# EAGLE design untitled (EAGLE 6.1)
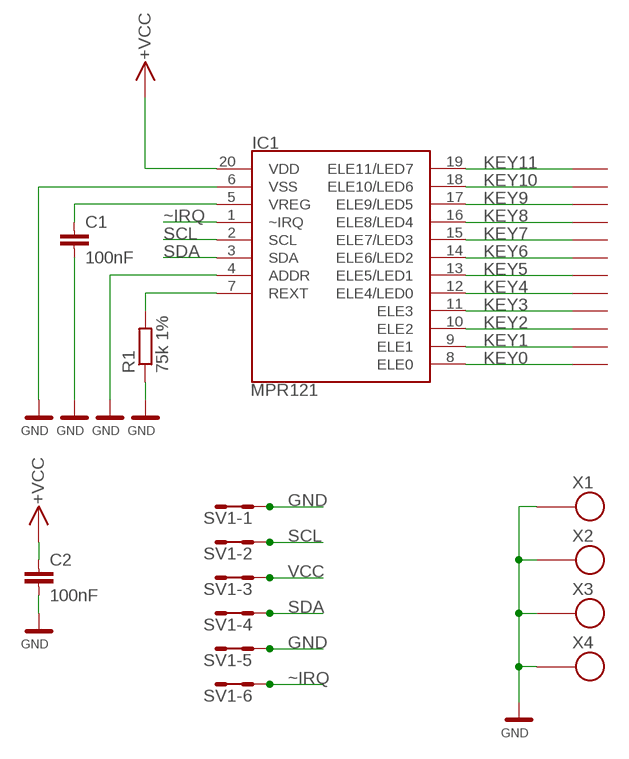
[diagram p0: schematic, sheet 1]

## Parts
C1  100nF  C0805  [C0805]
C2  100nF  C0805  [C0805]
IC1  MPR121  MPR121QFN20  [QFN-20-0.4MM]
R1  75k 1%  R0805  [0805]
SV1  MA06-2  [MA06-2]
U$1  TL_DOTYK_10_15  [PLOSKA10_15]
U$2  TL_DOTYK_10_15  [PLOSKA10_15]
U$3  TL_DOTYK_10_15  [PLOSKA10_15]
U$4  TL_DOTYK_10_15  [PLOSKA10_15]
U$5  TL_DOTYK_10_15  [PLOSKA10_15]
U$6  TL_DOTYK_10_15  [PLOSKA10_15]
U$7  TL_DOTYK_10_15  [PLOSKA10_15]
U$8  TL_DOTYK_10_15  [PLOSKA10_15]
U$9  TL_DOTYK_10_15  [PLOSKA10_15]
U$10  TL_DOTYK_10_15  [PLOSKA10_15]
U$11  TL_DOTYK_10_15  [PLOSKA10_15]
U$12  TL_DOTYK_10_15  [PLOSKA10_15]
X1  SROUB3M  [SROUB3M]
X2  SROUB3M  [SROUB3M]
X3  SROUB3M  [SROUB3M]
X4  SROUB3M  [SROUB3M]

## Nets
GND: C1.2 C2.2 IC1.4(ADDR) IC1.6(VSS) R1.1 SV1.1 SV1.2 SV1.9 SV1.10 X1.P$1 X2.P$1 X3.P$1 X4.P$1
KEY0: IC1.8(ELE0) U$1.P$1
KEY1: IC1.9(ELE1) U$2.P$1
KEY2: IC1.10(ELE2) U$3.P$1
KEY3: IC1.11(ELE3) U$4.P$1
KEY4: IC1.12(ELE4/LED0) U$5.P$1
KEY5: IC1.13(ELE5/LED1) U$6.P$1
KEY6: IC1.14(ELE6/LED2) U$7.P$1
KEY7: IC1.15(ELE7/LED3) U$8.P$1
KEY8: IC1.16(ELE8/LED4) U$9.P$1
KEY9: IC1.17(ELE9/LED5) U$10.P$1
KEY10: IC1.18(ELE10/LED6) U$11.P$1
KEY11: IC1.19(ELE11/LED7) U$12.P$1
REXT: IC1.7(REXT) R1.2
SCL: IC1.2(SCL) SV1.3 SV1.4
SDA: IC1.3(SDA) SV1.7 SV1.8
VCC: C2.1 IC1.20(VDD) SV1.5 SV1.6 ; supply symbol labelled +VCC
VREG: C1.1 IC1.5(VREG)
~IRQ: IC1.1(~IRQ) SV1.11 SV1.12

## Library data of the parts
C1 C2 = moje_C:C0805
IC1 = SparkFun:MPR121: MPR121 Capacitive Touch Sensor Controller
R1 = moje_R:R0805
SV1 = moje_hrebinky:MA06-2: PIN HEADER; OC_FARNELL: unknown; OC_NEWARK: unknown
U$1-U$12 = moje_tlacitka:TL_DOTYK_10_15: Ploska pro kapacitni talcitko 10x15mm
X1-X4 = moje:SROUB3M

## Board
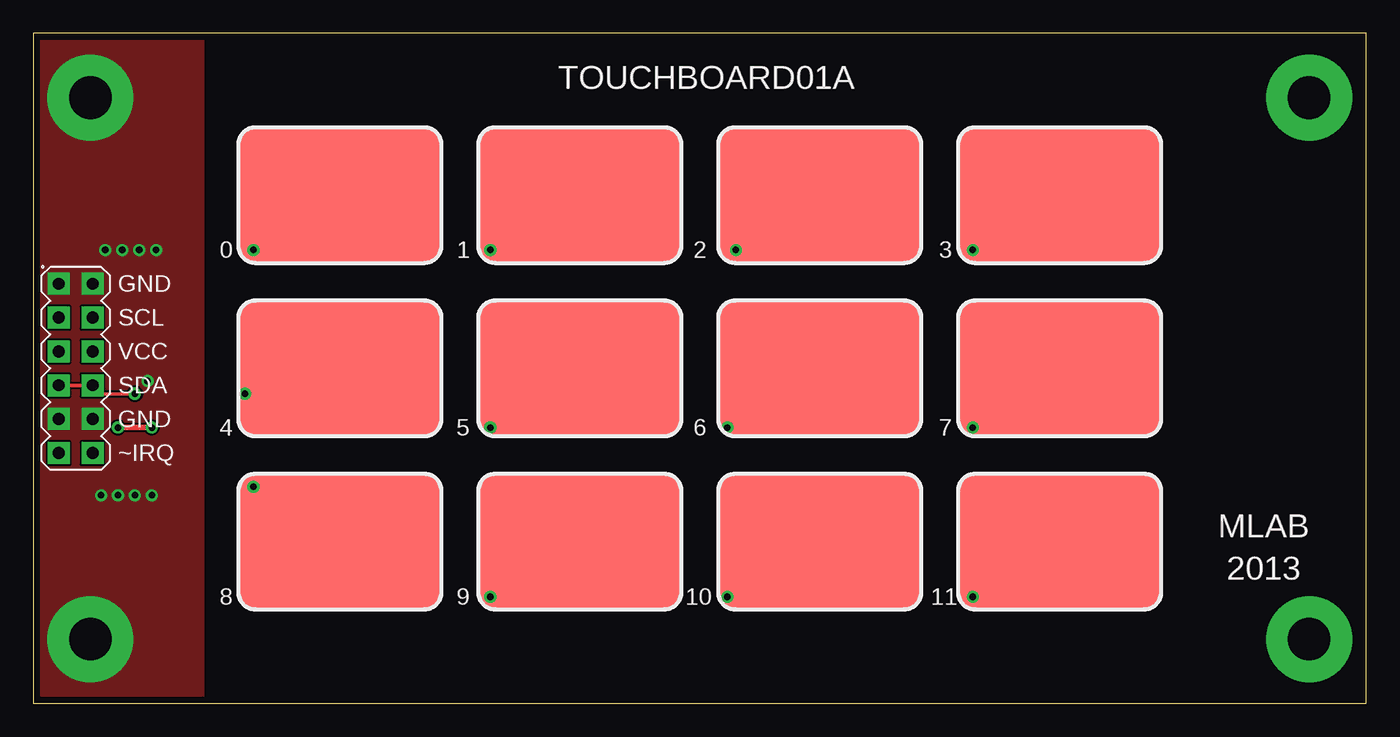
[diagram p1: board, top side]
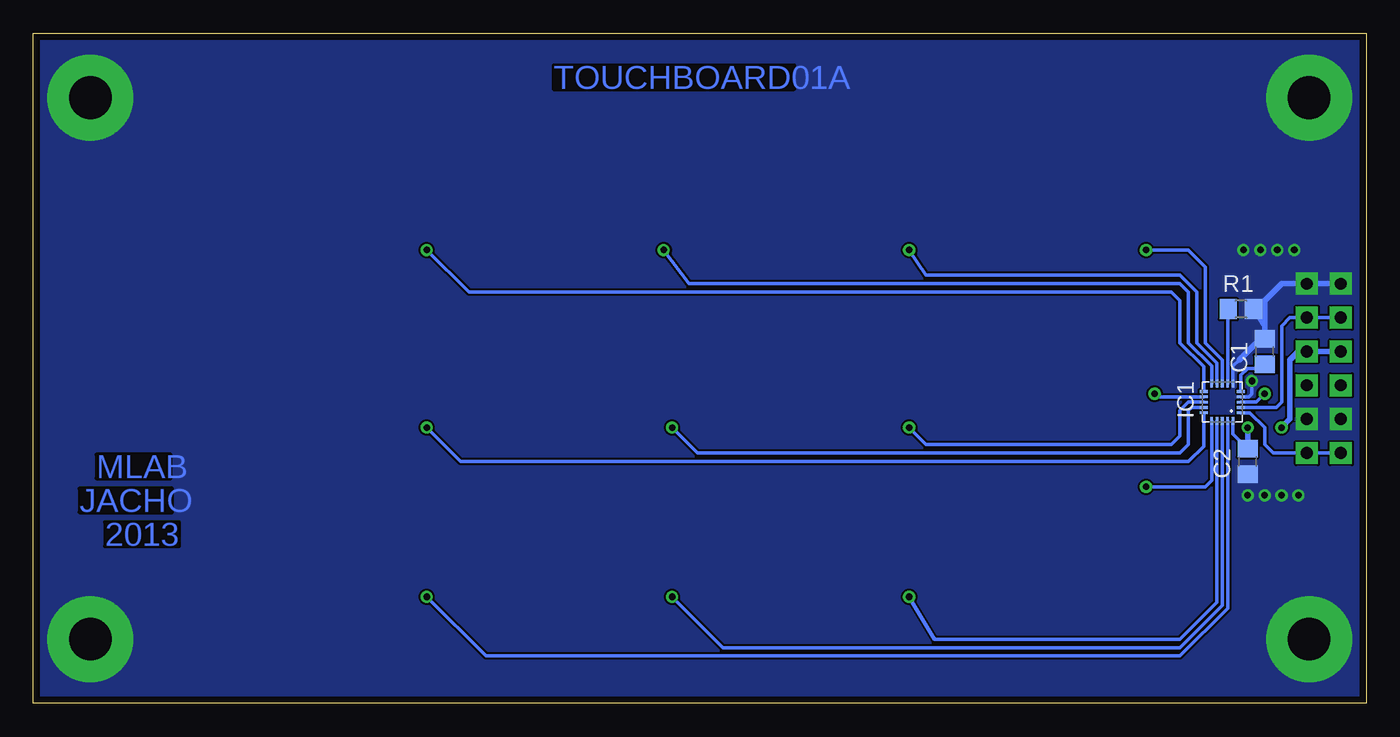
[diagram p2: board, bottom side, seen from below]

Size 100 x 50.29 mm. Coordinates in mm from the lower left corner, seen from the top.
Outline: 0,0 100,0 100,50.29 0,50.29 0,0
Copper layers (1*16): Top 0.035mm / dielectric 1.5mm / Bottom 0.035mm
Design rules: minimum track width 8mil, minimum drill 16mil, track to track 6mil, track to pad 6mil, pad to pad 6mil, via to via 6mil, smd to smd 6mil, copper to edge 20mil, drill to drill 8mil, minimum pad ring 10mil, minimum via ring 8mil, stop-mask expansion 4mil, vias tented up to drill 25mil, thermal gap 0mil

### Footprints (pad centres in the part's own frame; a part is rotated, then mirrored left to right if it is on the bottom)
C0805 = smd 1.3 x 1.5: 1 -0.95,0; 2 0.95,0
QFN-20-0.4MM = smd 0.6 x 0.2: 1 -1.4,0.8; 2 -1.4,0.4; 3 -1.4,0; 4 -1.4,-0.4; 5 -1.4,-0.8; 11 1.4,-0.8; 12 1.4,-0.4; 13 1.4,0; 14 1.4,0.4; 15 1.4,0.8 | smd 0.2 x 0.6: 6 -0.8,-1.4; 7 -0.4,-1.4; 8 0,-1.4; 9 0.4,-1.4; 10 0.8,-1.4; 16 0.8,1.4; 17 0.4,1.4; 18 0,1.4; 19 -0.4,1.4; 20 -0.8,1.4
0805 = smd 1.3 x 1.5: 1 -0.95,0; 2 0.95,0
MA06-2 = drill 0.889 pad 1.651 square: 1 -6.35,-1.27; 2 -6.35,1.27; 3 -3.81,-1.27; 4 -3.81,1.27; 5 -1.27,-1.27; 6 -1.27,1.27; 7 1.27,-1.27; 8 1.27,1.27; 9 3.81,-1.27; 10 3.81,1.27; 11 6.35,-1.27; 12 6.35,1.27
PLOSKA10_15 = smd 15 x 10: P$1 0,0
SROUB3M = drill 3.2 pad 6.452: P$1 0,0

### Placement (x,y rotation side)
C1  7.62,26.42 90 bottom
C2  8.89,18.16 270 bottom
IC1  10.79,22.61 180 bottom
R1  9.4,29.59 180 bottom
SV1  3.17,25.15 270 top
U$1  23,38.15 0 top
U$2  41,38.15 0 top
U$3  59,38.15 0 top
U$4  77,38.15 0 top
U$5  23,25.15 0 top
U$6  41,25.15 0 top
U$7  59,25.15 0 top
U$8  77,25.15 0 top
U$9  23,12.15 0 top
U$10  41,12.15 0 top
U$11  59,12.15 0 top
U$12  77,12.15 0 top
X1  4.28,4.83 0 top
X2  95.72,4.83 0 top
X3  4.28,45.47 0 top
X4  95.72,45.47 0 top

### Tracks (layer width: path | path; a pad name or v marks a point on that pad's centre or on a via)
GND  (via drill 0.5)
  Bottom 0.254: IC1.6 9.99,25.31 9.53,25.78 | IC1.4 8.81,23.01 8.57,23.24 v8.57,24.19
  Bottom 0.406: 9.53,25.78 8.26,27.05 7.94,27.05 C1.2 7.62,28.32 | SV1.1 SV1.2 6.35,31.5 7.62,30.23 7.62,28.32 | R1.1 7.62,28.32
  other vias: 5.08,15.62 6.35,15.62 7.62,15.62 8.89,15.62 5.4,34.04 6.67,34.04 7.94,34.04 9.21,34.04
  pour Bottom: 0,50.55 0,-0.25 99.69,-0.25 99.69,50.55
  pour Top: 0.64,50.55 0,50.55 0,-0.25 12.7,-0.25 12.7,49.91
KEY0  (via drill 0.5)
  Top 0.254: v16.51,34.04 19.05,34.04 22.86,37.85 22.86,38.01 U$1.P$1
  Bottom 0.254: v16.51,34.04 13.34,34.04 12.06,32.77 12.06,27.05 10.79,25.78 IC1.8
KEY1  (via drill 0.5)
  Top 0.254: v34.29,34.04 36.89,34.04 U$2.P$1
  Bottom 0.254: IC1.9 11.2,25.55 12.7,27.05 12.7,30.86 13.97,32.13 33.02,32.13 v34.29,34.04
KEY2  (via drill 0.5)
  Top 0.254: v52.7,34.04 54.89,34.04 U$3.P$1
  Bottom 0.254: IC1.10 11.6,25.31 13.34,27.05 13.34,30.86 13.97,31.5 50.8,31.5 v52.7,34.04
KEY3  (via drill 0.5)
  Top 0.254: v70.48,34.04 72.89,34.04 U$4.P$1
  Bottom 0.254: IC1.11 12.2,25.28 13.97,27.05 13.97,30.23 14.61,30.86 67.31,30.86 v70.48,34.04
KEY4  (via drill 0.5)
  Top 0.254: v15.88,23.24 22.86,23.24 22.86,25.15 U$5.P$1
  Bottom 0.254: IC1.12 15.88,23.01 v15.88,23.24
KEY5  (via drill 0.5)
  Top 0.254: v34.29,20.7 36.55,20.7 U$6.P$1
  Bottom 0.254: v34.29,20.7 33.02,19.43 14.61,19.43 13.97,20.07 13.97,21.97 13.34,22.61 IC1.13
KEY6  (via drill 0.5)
  Top 0.254: v52.07,20.7 54.55,20.7 U$7.P$1
  Bottom 0.254: v52.07,20.7 50.16,18.8 13.97,18.8 13.34,19.43 13.34,21.97 13.1,22.21 IC1.14
KEY7  (via drill 0.5)
  Top 0.254: v70.48,20.7 72.56,20.7 U$8.P$1
  Bottom 0.254: v70.48,20.7 67.94,18.16 13.34,18.16 12.2,19.3 IC1.15
KEY8  (via drill 0.5)
  Top 0.254: v16.51,16.26 19.68,16.26 22.86,13.08 22.86,12.29 U$9.P$1
  Bottom 0.254: IC1.16 11.6,16.73 12.06,16.26 v16.51,16.26
KEY9  (via drill 0.5)
  Top 0.254: v34.29,8 36.85,8 U$10.P$1
  Bottom 0.254: IC1.17 11.2,7.6 13.97,4.83 32.38,4.83 v34.29,8
KEY10  (via drill 0.5)
  Top 0.254: v52.07,8 54.85,8 U$11.P$1
  Bottom 0.254: IC1.18 10.79,7.37 13.97,4.19 48.26,4.19 v52.07,8
KEY11  (via drill 0.5)
  Top 0.254: v70.48,8 72.86,8 U$12.P$1
  Bottom 0.254: IC1.19 10.39,7.13 13.97,3.56 66.04,3.56 v70.48,8
REXT
  Bottom 0.254: IC1.7 10.39,28.24 R1.2
SCL
  Bottom 0.254: IC1.2 6.75,22.21 6.35,22.61 6.35,28.32 5.71,28.96 SV1.4 SV1.3
SDA  (via drill 0.5)
  Top 0.254: v7.62,23.24 5.08,23.24 SV1.8 SV1.7
  Bottom 0.254: IC1.3 8.26,22.61 v7.62,23.24
VCC  (via drill 0.5)
  Top 0.406: v6.35,20.7 v8.89,20.7
  Bottom 0.254: IC1.20 9.99,20.22 C2.1
  Bottom 0.406: SV1.5 SV1.6 5.08,26.42 5.71,25.78 5.71,21.34 v6.35,20.7 | v8.89,20.7 C2.1
VREG
  Bottom 0.254: IC1.5 9.39,24.64 8.89,25.15 7.93,25.15 C1.1
~IRQ
  Bottom 0.254: SV1.11 SV1.12 6.99,18.8 7.62,19.43 7.62,20.7 8.72,21.81 IC1.1

### Text on the board
Bottom: TOUCHBOARD01A | MLAB | JACHO | 2013
tPlace: TOUCHBOARD01A | 0 | 1 | 2 | 3 | GND | SCL | VCC | SDA | GND | 4 | 5 | 6 | 7 | ~IRQ | MLAB | 2013 | 8 | 9 | 10 | 11